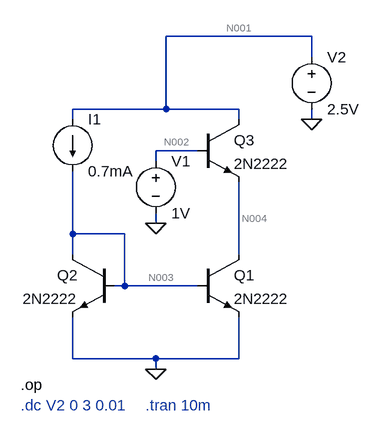
[diagram p0: schematic current_mirror (cs).asc]
current_mirror (cs).asc, the LTspice schematic file:
Version 4.1
SHEET 1 880 680
WIRE 416 -144 192 -144
WIRE 416 -112 416 -144
WIRE 192 -32 192 -144
WIRE 192 -32 48 -32
WIRE 304 -32 192 -32
WIRE 48 -16 48 -32
WIRE 304 -16 304 -32
WIRE 416 -16 416 -32
WIRE 240 32 176 32
WIRE 176 48 176 32
WIRE 176 144 176 128
WIRE 48 160 48 64
WIRE 128 160 48 160
WIRE 48 192 48 160
WIRE 304 192 304 80
WIRE 128 240 128 160
WIRE 128 240 112 240
WIRE 240 240 128 240
WIRE 48 352 48 288
WIRE 176 352 48 352
WIRE 304 352 304 288
WIRE 304 352 176 352
WIRE 176 368 176 352
FLAG 176 144 0
FLAG 416 -16 0
FLAG 176 368 0
SYMBOL npn 240 192 R0
SYMATTR InstName Q1
SYMATTR Value 2N2222
SYMBOL npn 112 192 M0
SYMATTR InstName Q2
SYMATTR Value 2N2222
SYMBOL npn 240 -16 R0
SYMATTR InstName Q3
SYMATTR Value 2N2222
SYMBOL current 48 -16 R0
SYMATTR InstName I1
SYMATTR Value 0.7mA
SYMBOL voltage 176 32 R0
SYMATTR InstName V1
SYMATTR Value 1V
SYMBOL voltage 416 -128 R0
SYMATTR InstName V2
SYMATTR Value 2.5V
TEXT -32 392 Left 2 !.op
TEXT -32 424 Left 2 ;.dc V2 0 3 0.01
TEXT 160 424 Left 2 ;.tran 10m

The netlist it stands for:
* current_mirror (cs).asc
Q1 N004 N003 0 0 2N2222
Q2 N003 N003 0 0 2N2222
Q3 N001 N002 N004 0 2N2222
I1 N001 N003 0.7mA
V1 N002 0 1V
V2 N001 0 2.5V
.model NPN NPN
.model PNP PNP
.lib standard.bjt
.op
* .dc V2 0 3 0.01
* .tran 10m
.backanno
.end

* Results of the author's LTspice run, read from the files saved beside the schematic
* Operating Point:
*   V(n003) = 645.9 mV
*   V(n002) = 1 V
*   V(n004) = 354.7 mV
*   V(n001) = 2.5 V
*   Ic(Q1) = 691 µA
*   Ib(Q1) = 3.474 µA
*   Ie(Q1) = -694.5 µA
*   Is(Q1) = 0 A
*   I(V1) = -3.395 µA
*   Ic(Q3) = 687.6 µA
*   Ib(Q3) = 3.395 µA
*   Ie(Q3) = -691 µA
*   Is(Q3) = 0 A
*   I(V2) = -1.388 mA
*   Ic(Q2) = 693.1 µA
*   Ib(Q2) = 3.473 µA
*   Ie(Q2) = -696.5 µA
*   Is(Q2) = 0 A
*   I(I1) = 700 µA